# EAGLE schematic ImprovedMCU (EAGLE 9.6.2)
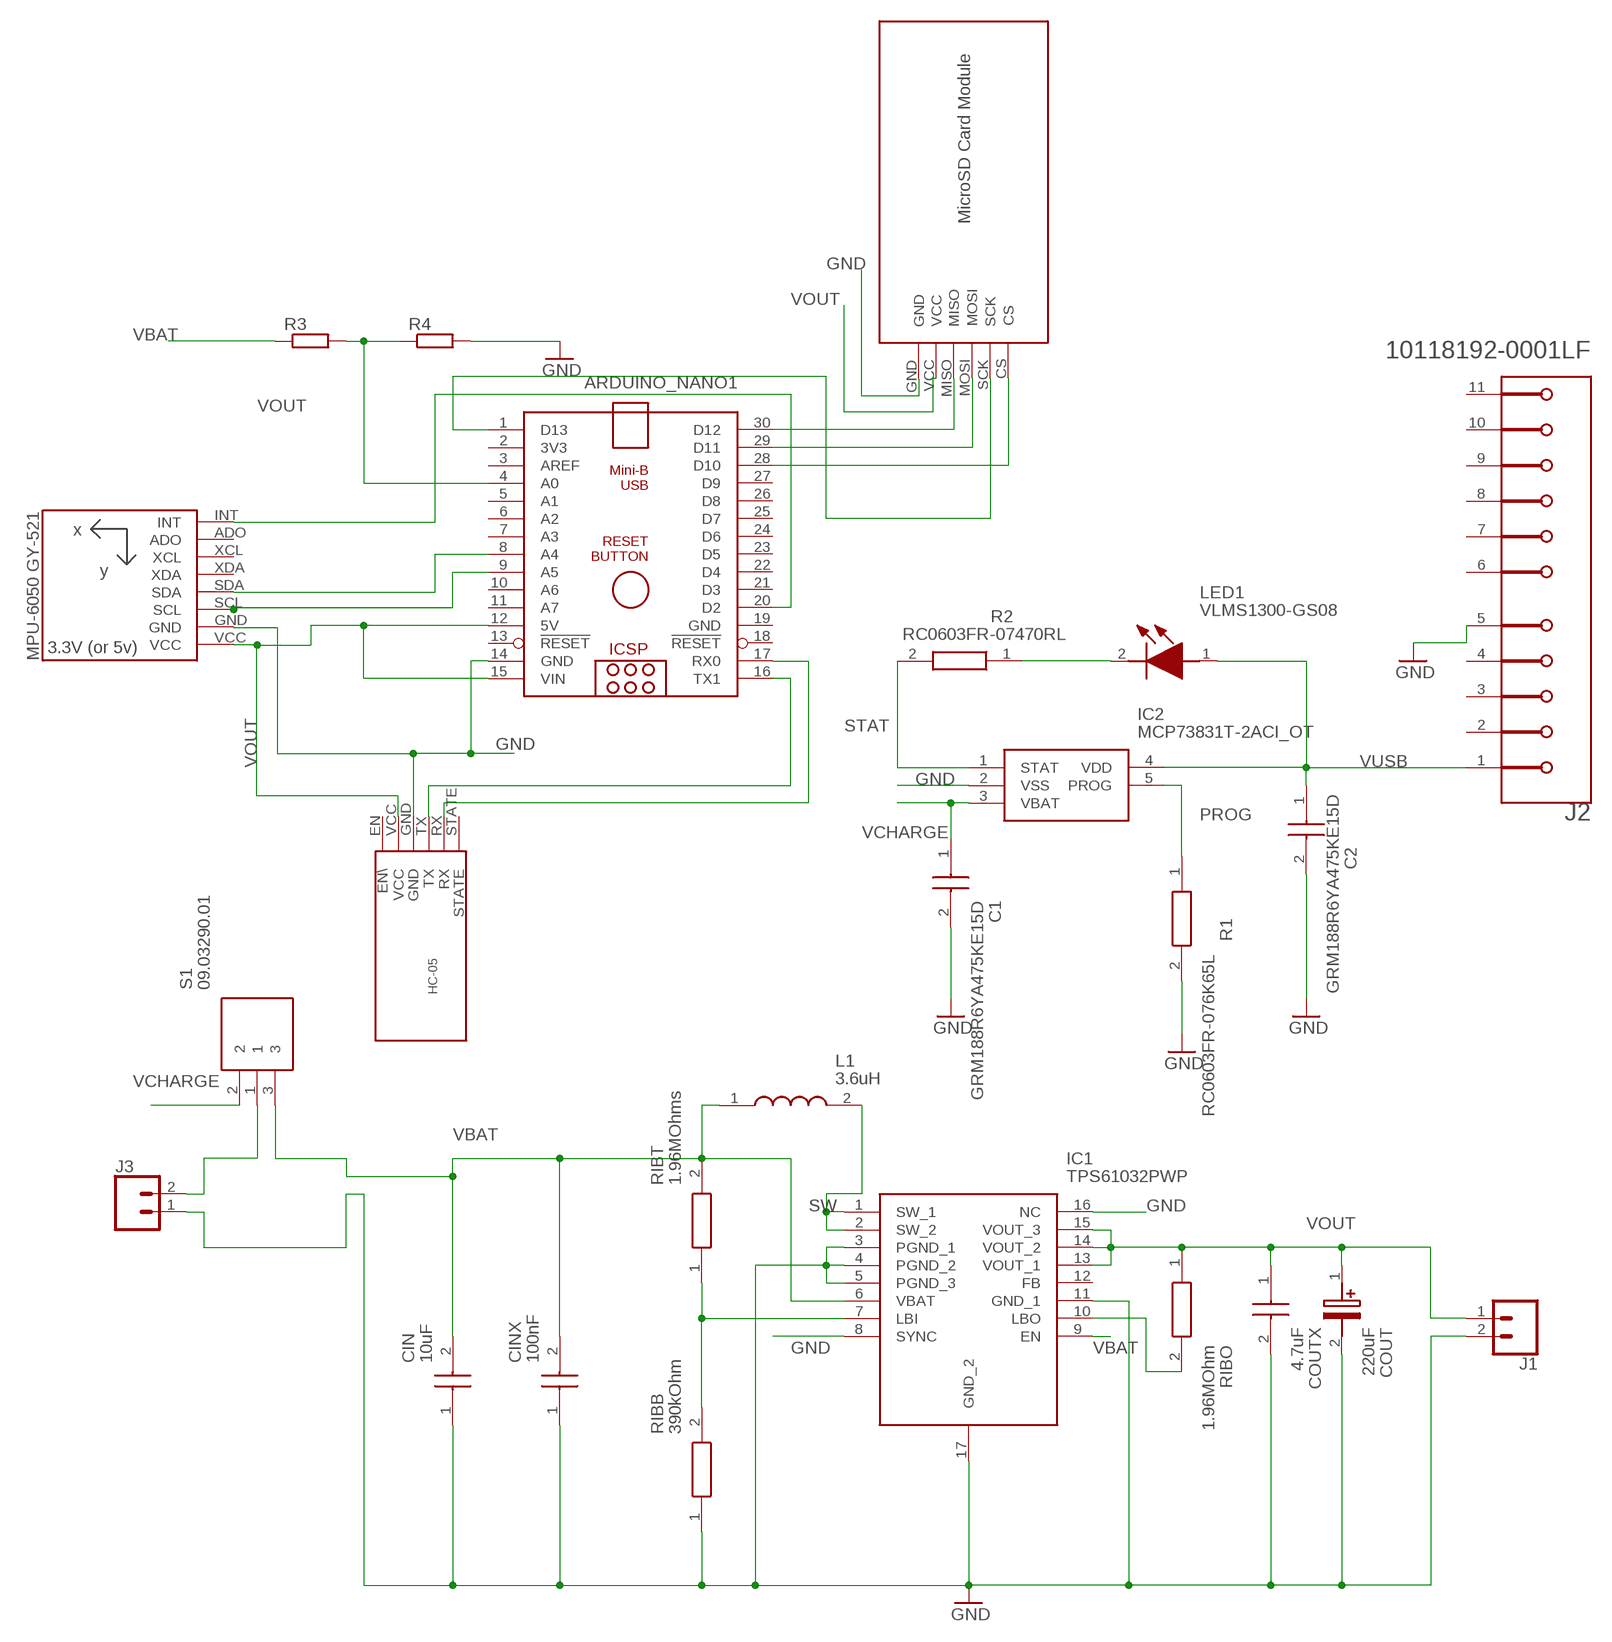
[diagram p0: schematic, sheet 1]

## Parts
ARDUINO_NANO1  ARDUINO_NANO  [ARDUINO_NANO]
C1  GRM188R6YA475KE15D  [CAPC1608X90N]
C2  GRM188R6YA475KE15D  [CAPC1608X90N]
CIN  10uF  GRJ155R60J106ME11D  [CAPC1005X70N]
CINX  100nF  GRM155R71A104KA01D  [CAPC1005X55N]
COUT  220uF  6TPE220MAZB  [POSCAP_B1_B1S_B1G_B15G_B2_B2S]
COUTX  4.7uF  GRM155R60J475ME87D  [CAPC1005X55N]
IC1  TPS61032PWP  [SOP65P640X120-17N]
IC2  MCP73831T-2ACI_OT  [SOT95P270X145-5N]
J1  CONN_02  [1X02]
J2  AMPHENOL_ICC_-_FCI_10118192-0001LFAMPHENOL_ICC_-_FCI_10118192-0001LF_0_0  [AMPHENOL_ICC_-_FCI_10118192-0001LF_0]
J3  CONN_02JST-PTH-2  [JST-2-PTH]
L1  3.6uH  7447798360  [WE-PDF59]
LED1  VLMS1300-GS08  [VLMS1300GS08]
R1  RC0603FR-076K65L  [RESC1608X55N]
R2  RC0603FR-07470RL  [RESC1608X55N]
R3  R-EU_0207/12  [0207/12]
R4  R-EU_0207/12  [0207/12]
RIBB  390kOhm  RC0603FR-07390KL  [RESC1608X55N]
RIBO  1.96MOhm  CRCW04021M96FKED  [RESC1005X40N]
RIBT  1.96MOhms  CRCW04021M96FKED  [RESC1005X40N]
S1  09.03290.01  [09.03290.01]
U1  GY-521MPU6050  [GY-521]
U$1  MICROSDMODULE  [MICROSDMODULE]
U$2  HC-05  [HC-05]

## Nets
GND: C1.2 C2.2 CIN.1 CINX.1 COUT.2(-) COUTX.2 IC1.3(PGND_1) IC1.4(PGND_2) IC1.5(PGND_3) IC1.8(SYNC) IC1.11(GND_1) IC1.16(NC) IC1.17(GND_2) IC2.2(VSS) J1.2 J2.5 J3.1 R1.2 R4.2 RIBB.1 U1.GND U$1.GND U$2.GND
N$1: J3.2 S1.1
N$3: ARDUINO_NANO1.14(GND)
N$4: IC1.10(LBO) RIBO.2
N$5: IC1.7(LBI) RIBB.2 RIBT.1
N$6: ARDUINO_NANO1.16(TX1) U$2.TX
N$7: ARDUINO_NANO1.17(RX0) U$2.RX
N$8: ARDUINO_NANO1.20(D2) U1.INT
N$9: ARDUINO_NANO1.9(A5) U1.SCL
N$10: ARDUINO_NANO1.12(5V) ARDUINO_NANO1.15(VIN)
N$11: ARDUINO_NANO1.8(A4) U1.SDA
N$12: LED1.2(K) R2.1
N$13: ARDUINO_NANO1.4(A0) R3.2 R4.1
N$15: ARDUINO_NANO1.30(D12) U$1.MISO
N$16: ARDUINO_NANO1.29(D11) U$1.MOSI
N$17: ARDUINO_NANO1.28(D10) U$1.CS
N$18: ARDUINO_NANO1.1(D13) U$1.SCK
PROG: IC2.5(PROG) R1.1
STAT: IC2.1(STAT) R2.2
SW: IC1.1(SW_1) IC1.2(SW_2) L1.2
VBAT: CIN.2 CINX.2 IC1.6(VBAT) IC1.9(EN) L1.1 R3.1 RIBT.2 S1.3
VCHARGE: C1.1 IC2.3(VBAT) S1.2
VOUT: COUT.1(+) COUTX.1 IC1.13(VOUT_1) IC1.14(VOUT_2) IC1.15(VOUT_3) J1.1 RIBO.1 U1.VCC U$1.VCC U$2.VCC
VUSB: C2.1 IC2.4(VDD) J2.1 LED1.1(A)
Unconnected: ARDUINO_NANO1.2(3V3) ARDUINO_NANO1.3(AREF) ARDUINO_NANO1.5(A1) ARDUINO_NANO1.6(A2) ARDUINO_NANO1.7(A3) ARDUINO_NANO1.10(A6) ARDUINO_NANO1.11(A7) ARDUINO_NANO1.13(!RESET) ARDUINO_NANO1.18(!RESET) ARDUINO_NANO1.21(D3) ARDUINO_NANO1.22(D4) ARDUINO_NANO1.23(D5) ARDUINO_NANO1.24(D6) ARDUINO_NANO1.25(D7) ARDUINO_NANO1.26(D8) ARDUINO_NANO1.27(D9) IC1.12(FB) J2.2 J2.3 J2.4 J2.6(MNT_1) J2.7(MNT_2) J2.8(MNT_3) J2.9(MNT_4) J2.10(MNT_5) J2.11(MNT_6) U1.ADO U1.XCL U1.XDA U$2.EN(EN\) U$2.STATE

## Power pins joined to a net without a drawn wire
GND: ARDUINO_NANO1.19(GND)

## Library data of the parts
ARDUINO_NANO1 = ArduinoNanoV30:ARDUINO_NANO: Arduino Nano V3.0 Overview: The Arduino Nano is a small, complete, and breadboard-friendly board based on the ATmega328 (Arduino Nano 3.x) or ATmega168 (Arduino Nano 2.x). It has more or less the same functionality of the Arduino Duemilanove, but in a different package. It lacks only a DC power jack, and works with a Mini-B USB cable instead of a standard one. The Nano was designed and is being produced by Gravitech. Specifications: Microcontroller Atmel ATmega168 or ATmega328 Operating Voltage (logic level) 5 V Input Voltage (recommended) 7-12 V Input Voltage (limits) 6-20 V Digital I/O Pins 14 (of which 6 provide PWM output) Analog Input Pins 8 DC Current per I/O Pin 40 mA Flash Memory 16 KB (ATmega168) or 32 KB (ATmega328) of which 2 KB used by bootloader SRAM 1 KB (ATmega168) or 2 KB (ATmega328) EEPROM 512 bytes (ATmega168) or 1 KB (ATmega328) Clock Speed 16 MHz Dimensions 0.73" x 1.70" Length 45 mm Width 18 mm Weigth 5 g Power: The Arduino Nano can be powered via the Mini-B USB connection, 6-20V unregulated external power supply (pin 30), or 5V regulated external power supply (pin 27). The power source is automatically selected to the highest voltage source. Memory: The ATmega168 has 16 KB of flash memory for storing code (of which 2 KB is used for the bootloader); the ATmega328 has 32 KB, (also with 2 KB used for the bootloader). The ATmega168 has 1 KB of SRAM and 512 bytes of EEPROM (which can be read and written with the EEPROM library); the ATmega328 has 2 KB of SRAM and 1 KB of EEPROM. Input and Output: Each of the 14 digital pins on the Nano can be used as an input or output, using pinMode(), digitalWrite(), and digitalRead() functions. They operate at 5 volts. Each pin can provide or receive a maximum of 40 mA and has an internal pull-up resistor (disconnected by default) of 20-50 kOhms. In addition, some pins have specialized functions. Visit Arduino - ArduinoBoardNano <https://www.arduino.cc/en/Main/ArduinoBoardNano>
C1 C2 = SamacSys_Parts:GRM188R6YA475KE15D: Multilayer Ceramic Capacitors MLCC - SMD/SMT 0603 4.7uF 35volts X5R 10% Source: Datasheet <https://psearch.en.murata.com/capacitor/product/GRM188R6YA475KE15#.html>; DESCRIPTION: Multilayer Ceramic Capacitors MLCC - SMD/SMT 0603 4.7uF 35volts X5R 10%; HEIGHT: 0.9mm; MANUFACTURER_NAME: Murata Electronics; MANUFACTURER_PART_NUMBER: GRM188R6YA475KE15D; MOUSER_PART_NUMBER: 81-GRM188R6YA475KE5D; MOUSER_PRICE-STOCK: https://www.mouser.co.uk/ProductDetail/Murata-Electronics/GRM188R6YA475KE15D?qs=eeBpzGFlv%252B%2FTEUAkSXFIlg%3D%3D
CIN = SamacSys_Parts:GRJ155R60J106ME11D: Multilayer Ceramic Capacitors MLCC - SMD/SMT 0402 10uF 6.3volts *Derate Voltage/Temp Source: Datasheet <https://altium.componentsearchengine.com/Datasheets/1/GRJ155R60J106ME11D.pdf>; DESCRIPTION: Multilayer Ceramic Capacitors MLCC - SMD/SMT 0402 10uF 6.3volts *Derate Voltage/Temp; HEIGHT: 0.7mm; MANUFACTURER_NAME: Murata Electronics; MANUFACTURER_PART_NUMBER: GRJ155R60J106ME11D; MOUSER_PART_NUMBER: 81-GRJ155R60J106ME1D; MOUSER_PRICE-STOCK: https://www.mouser.co.uk/ProductDetail/Murata-Electronics/GRJ155R60J106ME11D?qs=I53XXhTNm8s0qq2xY2TjBg%3D%3D
CINX = SamacSys_Parts:GRM155R71A104KA01D: Ceramic SMT capacitor 100nF 10Vdc Murata 0402 GRM 100nF Ceramic Multilayer Capacitor, 10 V dc X7R Dielectric ??10% Source: Datasheet <https://datasheet.datasheetarchive.com/originals/distributors/Datasheets_SAMA/ec4f1577dddcc7a13ddad897a28002d3.pdf>; DESCRIPTION: Ceramic SMT capacitor 100nF 10Vdc Murata 0402 GRM 100nF Ceramic Multilayer Capacitor, 10 V dc X7R Dielectric ??10%; HEIGHT: 0.55mm; MANUFACTURER_NAME: Murata Electronics; MANUFACTURER_PART_NUMBER: GRM155R71A104KA01D; MOUSER_PART_NUMBER: 81-GRM155R71A104KA1D; MOUSER_PRICE-STOCK: https://www.mouser.co.uk/ProductDetail/Murata-Electronics/GRM155R71A104KA01D?qs=8YPuuxuUzMIpJ%252BESZ%2Fj8CQ%3D%3D
COUT = SamacSys_Parts:6TPE220MAZB: Panasonic 220uF SMD Solid Polymer Tantalum Capacitor, 6.3 V dc +/-20%, POSCAP Series Source: Datasheet <http://industrial.panasonic.com/cdbs/www-data/pdf/AAA8000/AAA8000C36.pdf>; DESCRIPTION: Panasonic 220uF SMD Solid Polymer Tantalum Capacitor, 6.3 V dc +/-20%, POSCAP Series; HEIGHT: mm; MANUFACTURER_NAME: Panasonic; MANUFACTURER_PART_NUMBER: 6TPE220MAZB; MOUSER_PART_NUMBER: 667-6TPE220MAZB; MOUSER_PRICE-STOCK: https://www.mouser.co.uk/ProductDetail/Panasonic/6TPE220MAZB/?qs=OE1iw1LrrPEYdB6nQ0ttfA%3D%3D
COUTX = SamacSys_Parts:GRM155R60J475ME87D: Multilayer Ceramic Capacitors MLCC - SMD/SMT 0603 4.7uF 6.3volts *Derate Voltage/Temp Source: Datasheet <https://datasheet.datasheetarchive.com/originals/distributors/Datasheets_SAMA/ec4f1577dddcc7a13ddad897a28002d3.pdf>; DESCRIPTION: Multilayer Ceramic Capacitors MLCC - SMD/SMT 0603 4.7uF 6.3volts *Derate Voltage/Temp; HEIGHT: 0.55mm; MANUFACTURER_NAME: Murata Electronics; MANUFACTURER_PART_NUMBER: GRM155R60J475ME87D; MOUSER_PART_NUMBER: 81-GRM155R60J475ME8D; MOUSER_PRICE-STOCK: https://www.mouser.co.uk/ProductDetail/Murata-Electronics/GRM155R60J475ME87D?qs=pTGEtN%252BMLlBnU9jM8bPB0Q%3D%3D
IC1 = SamacSys_Parts:TPS61032PWP: 5-V Output, 1-A, 96% Efficient Boost Converter w/20uA Iq in TSSOP-16 Source: Datasheet <http://www.ti.com/lit/ds/symlink/tps61030.pdf>; DESCRIPTION: 5-V Output, 1-A, 96% Efficient Boost Converter w/20uA Iq in TSSOP-16; HEIGHT: 1.2mm; MANUFACTURER_NAME: Texas Instruments; MANUFACTURER_PART_NUMBER: TPS61032PWP; MOUSER_PART_NUMBER: 595-TPS61032PWP; MOUSER_PRICE-STOCK: https://www.mouser.co.uk/ProductDetail/Texas-Instruments/TPS61032PWP?qs=Gse6rAGbi7%252B07XodIBvuHQ%3D%3D
IC2 = SamacSys_Parts:MCP73831T-2ACI_OT: Li-Ion Charge Controller 4.2V SOT23-5 Source: Datasheet <http://ww1.microchip.com/downloads/en/DeviceDoc/20001984g.pdf>; DESCRIPTION: Li-Ion Charge Controller 4.2V SOT23-5; HEIGHT: 1.45mm; MANUFACTURER_NAME: Microchip; MANUFACTURER_PART_NUMBER: MCP73831T-2ACI/OT; MOUSER_PART_NUMBER: 579-MCP73831T-2ACIOT; MOUSER_PRICE-STOCK: https://www.mouser.co.uk/ProductDetail/Microchip-Technology-Atmel/MCP73831T-2ACI-OT?qs=yUQqVecv4qvbBQBGbHx0Mw%3D%3D
J1 = SparkFun-Connectors:CONN_02: Multi connection point. Often used as Generic Header-pin footprint for 0.1 inch spaced/style header connections On any of the 0.1 inch spaced packages, you can populate with these: Break Away Headers - Straight <https://www.sparkfun.com/products/116> (PRT-00116) Break Away Male Headers - Right Angle <https://www.sparkfun.com/products/553> (PRT-00553) Female Headers <https://www.sparkfun.com/products/115> (PRT-00115) Break Away Headers - Machine Pin <https://www.sparkfun.com/products/117> (PRT-00117) Break Away Female Headers - Swiss Machine Pin <https://www.sparkfun.com/products/743> (PRT-00743) For SCREWTERMINALS and SPRING TERMINALS visit here: Screw Terimnals on SparkFun.com <https://www.sparkfun.com/search/results?term=Screw+Terminals> (5mm/3.5mm/2.54mm spacing) This device is also useful as a general connection point to wire up your design to another part of your project. Our various solder wires solder well into these plated through hole pads. Hook-Up Wire - Assortment (Stranded, 22 AWG) <https://www.sparkfun.com/products/11375> (PRT-11375) Hook-Up Wire - Assortment (Solid Core, 22 AWG) <https://www.sparkfun.com/products/11367> (PRT-11367) View the entire wire category on our website here <https://www.sparkfun.com/categories/141> Special notes: Molex polarized connector foot print use with: PRT-08233 with associated crimp pins and housings. 2.54_SCREWTERM for use with PRT-10571. 3.5mm Screw Terminal footprints for PRT-08084 5mm Screw Terminal footprints for use with PRT-08432
J2 = FCI - 10118192-0001LF:AMPHENOL_ICC_-_FCI_10118192-0001LF: CONN RCPT USB2.0 MICRO B SMD R/A; AUTOMOTIVE: No; CENTROID_NOT_SPECIFIED: No; CONN_ORIENTATION: Right Angle; CONTACT_MATERIAL: Gold,Nickel; CURRENT_RATING: 1.8A; DATASHEET: https://cdn.amphenol-icc.com/media/wysiwyg/files/documentation/datasheet/inputoutput/io_usb_micro.pdf; DEVICE_CLASS_L1: Connectors; DEVICE_CLASS_L2: USB Connectors; DEVICE_CLASS_L3: unset; DIGIKEY_DESCRIPTION: CONN RCPT USB2.0 MICRO B SMD R/A; DIGIKEY_PART_NUMBER: 609-4613-1-ND; FOOTPRINT_URL: https://cdn.amphenol-icc.com/media/wysiwyg/files/drawing/10118192.pdf; FOOTPRINT_VARIANT_NAME_0: Recommended_Land_Pattern; HEIGHT: 3.08mm; IS_FEMALE: yes; LEAD_FREE: Yes; MF: Amphenol ICC / FCI; MFG_PACKAGE_IDENT: 0; MFG_PACKAGE_IDENT_DATE: 0; MFG_PACKAGE_IDENT_REV: 0; MOUSER_DESCRIPTION: Conn Micro USB Type B RCP 5 POS 0.65mm Solder RA SMD 5 Terminal 1 Port T/R; MOUSER_PART_NUMBER: 649-10118192-0001LF; MPN: 10118192-0001LF; NUMBER_OF_CONTACTS: 5; PACKAGE: CONN_USB; PITCH: 0.65mm; PREFIX: J; ROHS: Yes; SHIELDING: true; TEMPERATURE_RANGE_HIGH: +85°C; TEMPERATURE_RANGE_LOW: -55°C; USB_STANDARD: USB 2.0; VERIFICATION_VERSION: 0.0.0.3; VOLTAGE_RATING: 100V
J3 = SparkFun-Connectors:CONN_02: Multi connection point. Often used as Generic Header-pin footprint for 0.1 inch spaced/style header connections On any of the 0.1 inch spaced packages, you can populate with these: Break Away Headers - Straight <https://www.sparkfun.com/products/116> (PRT-00116) Break Away Male Headers - Right Angle <https://www.sparkfun.com/products/553> (PRT-00553) Female Headers <https://www.sparkfun.com/products/115> (PRT-00115) Break Away Headers - Machine Pin <https://www.sparkfun.com/products/117> (PRT-00117) Break Away Female Headers - Swiss Machine Pin <https://www.sparkfun.com/products/743> (PRT-00743) For SCREWTERMINALS and SPRING TERMINALS visit here: Screw Terimnals on SparkFun.com <https://www.sparkfun.com/search/results?term=Screw+Terminals> (5mm/3.5mm/2.54mm spacing) This device is also useful as a general connection point to wire up your design to another part of your project. Our various solder wires solder well into these plated through hole pads. Hook-Up Wire - Assortment (Stranded, 22 AWG) <https://www.sparkfun.com/products/11375> (PRT-11375) Hook-Up Wire - Assortment (Solid Core, 22 AWG) <https://www.sparkfun.com/products/11367> (PRT-11367) View the entire wire category on our website here <https://www.sparkfun.com/categories/141> Special notes: Molex polarized connector foot print use with: PRT-08233 with associated crimp pins and housings. 2.54_SCREWTERM for use with PRT-10571. 3.5mm Screw Terminal footprints for PRT-08084 5mm Screw Terminal footprints for use with PRT-08432; PROD_ID: CONN-09863; SKU: PRT-09914
L1 = SamacSys_Parts:7447798360: SMD-Power Inductor WE-PDF Source: Datasheet <https://componentsearchengine.com/Datasheets/1/7447798360.pdf>; DESCRIPTION: SMD-Power Inductor WE-PDF; HEIGHT: mm; MANUFACTURER_NAME: Wurth Elektronik; MANUFACTURER_PART_NUMBER: 7447798360; MOUSER_PART_NUMBER: 710-7447798360; MOUSER_PRICE-STOCK: https://www.mouser.com/Search/Refine.aspx?Keyword=710-7447798360
LED1 = SamacSys_Parts:VLMS1300-GS08: LED Uni-Color Super Red 639nm 2-Pin Chip 0603(1608Metric) T/R Source: Datasheet <https://datasheet.lcsc.com/szlcsc/Vishay-Intertech-VLMS1300-GS08_C83242.pdf>; DESCRIPTION: LED Uni-Color Super Red 639nm 2-Pin Chip 0603(1608Metric) T/R; HEIGHT: 1mm; MANUFACTURER_NAME: Vishay; MANUFACTURER_PART_NUMBER: VLMS1300-GS08; MOUSER_PART_NUMBER: 78-VLMS1300-GS08; MOUSER_PRICE-STOCK: https://www.mouser.co.uk/ProductDetail/Vishay-Semiconductors/VLMS1300-GS08?qs=uoVnq4yU%252B9LtZKILJuIDBQ%3D%3D
R1 = SamacSys_Parts:RC0603FR-076K65L: YAGEO (PHYCOMP) RC0603 F Source: Datasheet <https://datasheet.datasheetarchive.com/originals/distributors/Datasheets_SAMA/902f9e387b938f871d31120f5fc1d65e.pdf>; DESCRIPTION: YAGEO (PHYCOMP) RC0603 F; HEIGHT: 0.55mm; MANUFACTURER_NAME: KEMET; MANUFACTURER_PART_NUMBER: RC0603FR-076K65L
R2 = SamacSys_Parts:RC0603FR-07470RL: YAGEO - RC0603FR-07470RL - RES, THICK FILM, 470R, 1%, 0.1W, 0603, REEL Source: Datasheet <https://datasheet.datasheetarchive.com/originals/distributors/Datasheets_SAMA/902f9e387b938f871d31120f5fc1d65e.pdf>; DESCRIPTION: YAGEO - RC0603FR-07470RL - RES, THICK FILM, 470R, 1%, 0.1W, 0603, REEL; HEIGHT: 0.55mm; MANUFACTURER_NAME: KEMET; MANUFACTURER_PART_NUMBER: RC0603FR-07470RL; MOUSER_PART_NUMBER: 603-RC0603FR-07470RL; MOUSER_PRICE-STOCK: https://www.mouser.co.uk/ProductDetail/YAGEO/RC0603FR-07470RL?qs=gt6vzsuosg2Xv5elfMBXPA%3D%3D
R3 R4 = rcl:R-EU_: RESISTOR, European symbol; SPICEPREFIX: R
RIBB = SamacSys_Parts:RC0603FR-07390KL: RESISTOR, 0603 390K Ohms +/-1% 1/10 W Source: Datasheet <https://datasheet.datasheetarchive.com/originals/distributors/Datasheets_SAMA/902f9e387b938f871d31120f5fc1d65e.pdf>; DESCRIPTION: RESISTOR, 0603 390K Ohms +/-1% 1/10 W; HEIGHT: 0.55mm; MANUFACTURER_NAME: YAGEO (PHYCOMP); MANUFACTURER_PART_NUMBER: RC0603FR-07390KL; MOUSER_PART_NUMBER: 603-RC0603FR-07390KL; MOUSER_PRICE-STOCK: https://www.mouser.co.uk/ProductDetail/Yageo/RC0603FR-07390KL?qs=0yPvnVz5%2FmqaU3B9dqGZZA%3D%3D
RIBO RIBT = SamacSys_Parts:CRCW04021M96FKED: VISHAY - CRCW04021M96FKED. - RES, THICK FILM, 1M96, 1%, 0.063W, 0402 Source: Datasheet <https://componentsearchengine.com/Datasheets/1/CRCW04021M96FKED.pdf>; DESCRIPTION: VISHAY - CRCW04021M96FKED. - RES, THICK FILM, 1M96, 1%, 0.063W, 0402; HEIGHT: 0.4mm; MANUFACTURER_NAME: Vishay; MANUFACTURER_PART_NUMBER: CRCW04021M96FKED; MOUSER_PART_NUMBER: 71-CRCW04021M96FKED; MOUSER_PRICE-STOCK: https://www.mouser.com/Search/Refine.aspx?Keyword=71-CRCW04021M96FKED
S1 = SamacSys_Parts:09.03290.01: SPCO straight standard lever SIL switch 2 Way Through Hole SIP Switch SPST Source: Datasheet <https://media.digikey.com/pdf/Data Sheets/EAO PDFs/series1k2_201004.pdf>; DESCRIPTION: SPCO straight standard lever SIL switch 2 Way Through Hole SIP Switch SPST; HEIGHT: mm; MANUFACTURER_NAME: EOZ; MANUFACTURER_PART_NUMBER: 09.03290.01
U1 = gy-521:GY-521
U$1 = MicroSDMocule:MICROSDMODULE
U$2 = Bluetooth:HC-05